# EAGLE schematic PensRevA (EAGLE 6.4)
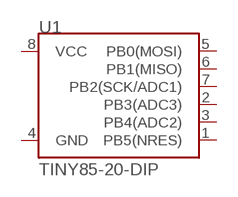
[diagram p0: schematic, sheet 1]

## Parts
U1  TINY85-20-DIP  ATTINY45TINY85-20-DIP  [DIP08]
Unconnected: U1.1(PB5(NRES)) U1.2(PB3(ADC3)) U1.3(PB4(ADC2)) U1.4(GND) U1.5(PB0(MOSI)) U1.6(PB1(MISO)) U1.7(PB2(SCK/ADC1)) U1.8(VCC)

## Library data of the parts
U1 = SparkFun-DigitalIC:ATTINY45: Atmel 8-pin 2/4/8kB flash uC; PROD_ID: IC-09445